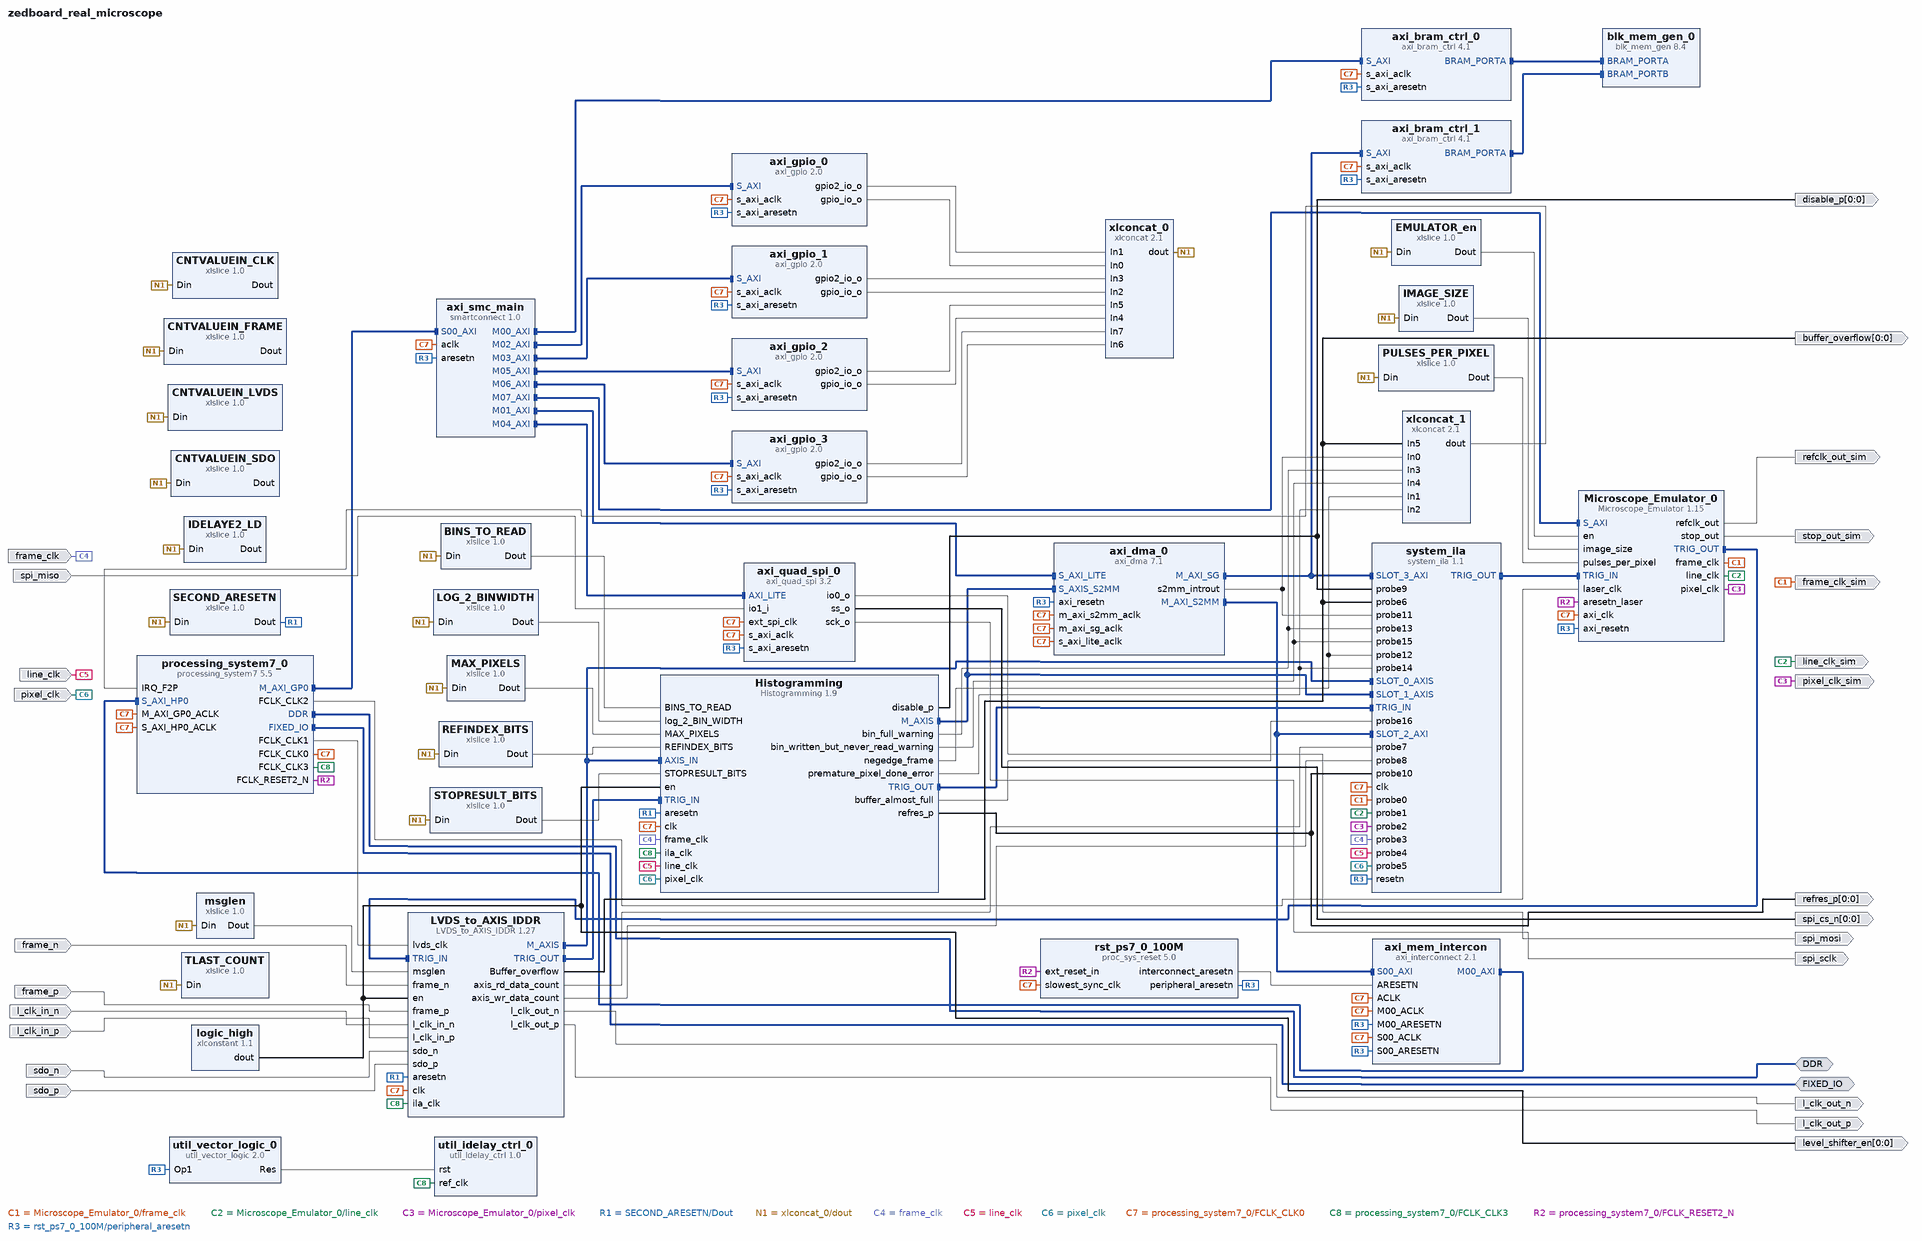
[diagram p0: block diagram of the top level]
# Vivado block design zedboard_real_microscope, xc7z020clg484-1, Vivado 2024.2
create_bd_design zedboard_real_microscope

create_bd_intf_port -mode Master -vlnv xilinx.com:interface:ddrx_rtl:1.0 DDR
create_bd_intf_port -mode Master -vlnv xilinx.com:display_processing_system7:fixedio_rtl:1.0 FIXED_IO
create_bd_port -dir I sdo_p
create_bd_port -dir I sdo_n
create_bd_port -dir I -type clk l_clk_in_p
create_bd_port -dir I -type clk l_clk_in_n
create_bd_port -dir I frame_p
create_bd_port -dir I frame_n
create_bd_port -dir O l_clk_out_n
create_bd_port -dir O l_clk_out_p
create_bd_port -dir O -from 0 -to 0 refres_p
create_bd_port -dir O -from 0 -to 0 disable_p
create_bd_port -dir O spi_mosi
create_bd_port -dir I spi_miso
create_bd_port -dir O spi_sclk
create_bd_port -dir O -from 0 -to 0 spi_cs_n
create_bd_port -dir O -from 0 -to 0 level_shifter_en
create_bd_port -dir O -from 0 -to 0 buffer_overflow
create_bd_port -dir I frame_clk
create_bd_port -dir I line_clk
create_bd_port -dir I pixel_clk
create_bd_port -dir O frame_clk_sim
create_bd_port -dir O line_clk_sim
create_bd_port -dir O pixel_clk_sim
create_bd_port -dir O refclk_out_sim
create_bd_port -dir O stop_out_sim

create_bd_cell -type ip -vlnv xilinx.com:ip:processing_system7:5.5 processing_system7_0
set_property -dict [list \
  CONFIG.PCW_APU_PERIPHERAL_FREQMHZ 667.0 \
  CONFIG.PCW_ENET0_ENET0_IO {MIO 16 .. 27} \
  CONFIG.PCW_ENET0_GRP_MDIO_ENABLE 1 \
  CONFIG.PCW_ENET0_GRP_MDIO_IO EMIO \
  CONFIG.PCW_ENET0_PERIPHERAL_ENABLE 1 \
  CONFIG.PCW_ENET_RESET_ENABLE 0 \
  CONFIG.PCW_EN_CLK1_PORT 1 \
  CONFIG.PCW_EN_CLK2_PORT 1 \
  CONFIG.PCW_EN_CLK3_PORT 1 \
  CONFIG.PCW_EN_RST0_PORT 0 \
  CONFIG.PCW_EN_RST2_PORT 1 \
  CONFIG.PCW_FCLK_CLK1_BUF TRUE \
  CONFIG.PCW_FCLK_CLK2_BUF TRUE \
  CONFIG.PCW_FCLK_CLK3_BUF TRUE \
  CONFIG.PCW_FPGA0_PERIPHERAL_FREQMHZ 100 \
  CONFIG.PCW_FPGA1_PERIPHERAL_FREQMHZ 250 \
  CONFIG.PCW_FPGA2_PERIPHERAL_FREQMHZ 10 \
  CONFIG.PCW_FPGA3_PERIPHERAL_FREQMHZ 200 \
  CONFIG.PCW_FPGA_FCLK1_ENABLE 1 \
  CONFIG.PCW_FPGA_FCLK2_ENABLE 1 \
  CONFIG.PCW_FPGA_FCLK3_ENABLE 1 \
  CONFIG.PCW_GPIO_MIO_GPIO_ENABLE 1 \
  CONFIG.PCW_GPIO_MIO_GPIO_IO MIO \
  CONFIG.PCW_I2C_RESET_ENABLE 0 \
  CONFIG.PCW_IRQ_F2P_INTR 1 \
  CONFIG.PCW_PERIPHERAL_BOARD_PRESET part0 \
  CONFIG.PCW_PRESET_BANK1_VOLTAGE {LVCMOS 1.8V} \
  CONFIG.PCW_QSPI_GRP_FBCLK_ENABLE 1 \
  CONFIG.PCW_QSPI_GRP_FBCLK_IO {MIO 8} \
  CONFIG.PCW_QSPI_GRP_SINGLE_SS_ENABLE 1 \
  CONFIG.PCW_QSPI_GRP_SINGLE_SS_IO {MIO 1 .. 6} \
  CONFIG.PCW_QSPI_PERIPHERAL_ENABLE 1 \
  CONFIG.PCW_QSPI_QSPI_IO {MIO 1 .. 6} \
  CONFIG.PCW_SD0_GRP_CD_ENABLE 1 \
  CONFIG.PCW_SD0_GRP_CD_IO {MIO 47} \
  CONFIG.PCW_SD0_GRP_WP_ENABLE 1 \
  CONFIG.PCW_SD0_GRP_WP_IO EMIO \
  CONFIG.PCW_SD0_PERIPHERAL_ENABLE 1 \
  CONFIG.PCW_SD0_SD0_IO {MIO 40 .. 45} \
  CONFIG.PCW_SDIO_PERIPHERAL_FREQMHZ 50 \
  CONFIG.PCW_SINGLE_QSPI_DATA_MODE x4 \
  CONFIG.PCW_TTC0_PERIPHERAL_ENABLE 1 \
  CONFIG.PCW_TTC0_TTC0_IO EMIO \
  CONFIG.PCW_UART1_PERIPHERAL_ENABLE 1 \
  CONFIG.PCW_UART1_UART1_IO {MIO 48 .. 49} \
  CONFIG.PCW_UART_PERIPHERAL_FREQMHZ 100 \
  CONFIG.PCW_UIPARAM_DDR_FREQ_MHZ 533.333 \
  CONFIG.PCW_UIPARAM_DDR_PARTNO {MT41K128M16 JT-125} \
  CONFIG.PCW_USB0_PERIPHERAL_ENABLE 1 \
  CONFIG.PCW_USB0_USB0_IO {MIO 28 .. 39} \
  CONFIG.PCW_USB_RESET_ENABLE 0 \
  CONFIG.PCW_USE_FABRIC_INTERRUPT 1 \
  CONFIG.PCW_USE_S_AXI_HP0 1 \
  CONFIG.preset None \
] [get_bd_cells processing_system7_0]
# 505 more settings of processing_system7_0 are not shown: defaults, MIO pin electricals, DDR timing, and values the tool derives
create_bd_cell -type ip -vlnv xilinx.com:ip:proc_sys_reset:5.0 rst_ps7_0_100M
create_bd_cell -type ip -vlnv xilinx.com:ip:axi_gpio:2.0 axi_gpio_0
set_property -dict [list \
  CONFIG.C_ALL_INPUTS_2 0 \
  CONFIG.C_ALL_OUTPUTS 1 \
  CONFIG.C_ALL_OUTPUTS_2 1 \
  CONFIG.C_GPIO2_WIDTH 32 \
  CONFIG.C_GPIO_WIDTH 32 \
  CONFIG.C_IS_DUAL 1 \
] [get_bd_cells axi_gpio_0]
create_bd_cell -type ip -vlnv xilinx.com:ip:xlslice:1.0 EMULATOR_en
set_property -dict {CONFIG.DIN_WIDTH 256} [get_bd_cells EMULATOR_en]
create_bd_cell -type ip -vlnv xilinx.com:ip:xlslice:1.0 msglen
set_property -dict {CONFIG.DIN_FROM 6 CONFIG.DIN_TO 1 CONFIG.DIN_WIDTH 256} [get_bd_cells msglen]
create_bd_cell -type ip -vlnv xilinx.com:ip:xlslice:1.0 SECOND_ARESETN
set_property -dict {CONFIG.DIN_FROM 12 CONFIG.DIN_TO 12 CONFIG.DIN_WIDTH 256} [get_bd_cells SECOND_ARESETN]
create_bd_cell -type ip -vlnv xilinx.com:ip:xlslice:1.0 CNTVALUEIN_LVDS
set_property -dict {CONFIG.DIN_FROM 11 CONFIG.DIN_TO 7 CONFIG.DIN_WIDTH 256} [get_bd_cells CNTVALUEIN_LVDS]
create_bd_cell -type ip -vlnv xilinx.com:ip:axi_quad_spi:3.2 axi_quad_spi_0
set_property -dict {CONFIG.C_FIFO_DEPTH 256 CONFIG.C_USE_STARTUP 0} [get_bd_cells axi_quad_spi_0]
create_bd_cell -type ip -vlnv xilinx.com:ip:axi_dma:7.1 axi_dma_0
set_property -dict {CONFIG.c_include_mm2s 0 CONFIG.c_s2mm_burst_size 16 CONFIG.c_sg_length_width 26} [get_bd_cells axi_dma_0]
create_bd_cell -type ip -vlnv xilinx.com:ip:axi_interconnect:2.1 axi_mem_intercon
set_property -dict {CONFIG.NUM_MI 1} [get_bd_cells axi_mem_intercon]
create_bd_cell -type ip -vlnv xilinx.com:ip:xlslice:1.0 LOG_2_BINWIDTH
set_property -dict {CONFIG.DIN_FROM 28 CONFIG.DIN_TO 13 CONFIG.DIN_WIDTH 256} [get_bd_cells LOG_2_BINWIDTH]
create_bd_cell -type ip -vlnv xilinx.com:ip:xlslice:1.0 REFINDEX_BITS
set_property -dict {CONFIG.DIN_FROM 98 CONFIG.DIN_TO 93 CONFIG.DIN_WIDTH 256} [get_bd_cells REFINDEX_BITS]
create_bd_cell -type ip -vlnv xilinx.com:ip:xlslice:1.0 STOPRESULT_BITS
set_property -dict {CONFIG.DIN_FROM 104 CONFIG.DIN_TO 99 CONFIG.DIN_WIDTH 256} [get_bd_cells STOPRESULT_BITS]
create_bd_cell -type ip -vlnv xilinx.com:ip:axi_gpio:2.0 axi_gpio_1
set_property -dict [list \
  CONFIG.C_ALL_INPUTS_2 0 \
  CONFIG.C_ALL_OUTPUTS 1 \
  CONFIG.C_ALL_OUTPUTS_2 1 \
  CONFIG.C_GPIO2_WIDTH 32 \
  CONFIG.C_GPIO_WIDTH 32 \
  CONFIG.C_IS_DUAL 1 \
] [get_bd_cells axi_gpio_1]
create_bd_cell -type ip -vlnv xilinx.com:ip:xlconcat:2.1 xlconcat_0
set_property -dict [list \
  CONFIG.IN0_WIDTH 32 \
  CONFIG.IN1_WIDTH 32 \
  CONFIG.IN2_WIDTH 32 \
  CONFIG.IN3_WIDTH 32 \
  CONFIG.IN4_WIDTH 32 \
  CONFIG.IN5_WIDTH 32 \
  CONFIG.IN6_WIDTH 32 \
  CONFIG.IN7_WIDTH 32 \
  CONFIG.NUM_PORTS 8 \
] [get_bd_cells xlconcat_0]
create_bd_cell -type ip -vlnv xilinx.com:ip:xlslice:1.0 TLAST_COUNT
set_property -dict {CONFIG.DIN_FROM 112 CONFIG.DIN_TO 105 CONFIG.DIN_WIDTH 256 CONFIG.DOUT_WIDTH 8} [get_bd_cells TLAST_COUNT]
create_bd_cell -type ip -vlnv xilinx.com:ip:xlconcat:2.1 xlconcat_1
set_property -dict {CONFIG.NUM_PORTS 6} [get_bd_cells xlconcat_1]
create_bd_cell -type ip -vlnv xilinx.com:ip:xlslice:1.0 BINS_TO_READ
set_property -dict {CONFIG.DIN_FROM 127 CONFIG.DIN_TO 113 CONFIG.DIN_WIDTH 256 CONFIG.DOUT_WIDTH 15} [get_bd_cells BINS_TO_READ]
create_bd_cell -type ip -vlnv xilinx.com:ip:xlslice:1.0 IMAGE_SIZE
set_property -dict {CONFIG.DIN_FROM 60 CONFIG.DIN_TO 29 CONFIG.DIN_WIDTH 256} [get_bd_cells IMAGE_SIZE]
create_bd_cell -type ip -vlnv xilinx.com:ip:xlslice:1.0 PULSES_PER_PIXEL
set_property -dict {CONFIG.DIN_FROM 92 CONFIG.DIN_TO 61 CONFIG.DIN_WIDTH 256} [get_bd_cells PULSES_PER_PIXEL]
create_bd_cell -type ip -vlnv xilinx.com:ip:util_vector_logic:2.0 util_vector_logic_0
set_property -dict {CONFIG.C_OPERATION not CONFIG.C_SIZE 1} [get_bd_cells util_vector_logic_0]
create_bd_cell -type ip -vlnv xilinx.com:ip:util_idelay_ctrl:1.0 util_idelay_ctrl_0
create_bd_cell -type ip -vlnv xilinx.com:ip:smartconnect:1.0 axi_smc_main
set_property -dict {CONFIG.NUM_CLKS 1 CONFIG.NUM_MI 8 CONFIG.NUM_SI 1} [get_bd_cells axi_smc_main]
create_bd_cell -type ip -vlnv xilinx.com:ip:axi_gpio:2.0 axi_gpio_2
set_property -dict [list \
  CONFIG.C_ALL_INPUTS_2 0 \
  CONFIG.C_ALL_OUTPUTS 1 \
  CONFIG.C_ALL_OUTPUTS_2 1 \
  CONFIG.C_GPIO2_WIDTH 32 \
  CONFIG.C_GPIO_WIDTH 32 \
  CONFIG.C_IS_DUAL 1 \
] [get_bd_cells axi_gpio_2]
create_bd_cell -type ip -vlnv xilinx.com:ip:axi_gpio:2.0 axi_gpio_3
set_property -dict [list \
  CONFIG.C_ALL_INPUTS 0 \
  CONFIG.C_ALL_INPUTS_2 0 \
  CONFIG.C_ALL_OUTPUTS 1 \
  CONFIG.C_ALL_OUTPUTS_2 1 \
  CONFIG.C_GPIO2_WIDTH 32 \
  CONFIG.C_GPIO_WIDTH 32 \
  CONFIG.C_IS_DUAL 1 \
] [get_bd_cells axi_gpio_3]
create_bd_cell -type ip -vlnv xilinx.com:ip:xlslice:1.0 MAX_PIXELS
set_property -dict {CONFIG.DIN_FROM 159 CONFIG.DIN_TO 128 CONFIG.DIN_WIDTH 256 CONFIG.DOUT_WIDTH 32} [get_bd_cells MAX_PIXELS]
create_bd_cell -type ip -vlnv xilinx.com:ip:blk_mem_gen:8.4 blk_mem_gen_0
set_property -dict [list \
  CONFIG.Assume_Synchronous_Clk true \
  CONFIG.EN_SAFETY_CKT false \
  CONFIG.Memory_Type True_Dual_Port_RAM \
  CONFIG.use_bram_block BRAM_Controller \
] [get_bd_cells blk_mem_gen_0]
create_bd_cell -type ip -vlnv xilinx.com:ip:axi_bram_ctrl:4.1 axi_bram_ctrl_1
set_property -dict {CONFIG.SINGLE_PORT_BRAM 1} [get_bd_cells axi_bram_ctrl_1]
create_bd_cell -type ip -vlnv xilinx.com:ip:axi_bram_ctrl:4.1 axi_bram_ctrl_0
set_property -dict {CONFIG.SINGLE_PORT_BRAM 1} [get_bd_cells axi_bram_ctrl_0]
create_bd_cell -type ip -vlnv xilinx.com:user:Histogramming:1.9 Histogramming
create_bd_cell -type ip -vlnv xilinx.com:user:LVDS_to_AXIS_IDDR:1.27 LVDS_to_AXIS_IDDR
create_bd_cell -type ip -vlnv xilinx.com:ip:xlconstant:1.1 logic_high
create_bd_cell -type ip -vlnv xilinx.com:ip:xlslice:1.0 CNTVALUEIN_CLK
set_property -dict {CONFIG.DIN_FROM 164 CONFIG.DIN_TO 160 CONFIG.DIN_WIDTH 256 CONFIG.DOUT_WIDTH 5} [get_bd_cells CNTVALUEIN_CLK]
create_bd_cell -type ip -vlnv xilinx.com:ip:xlslice:1.0 CNTVALUEIN_SDO
set_property -dict {CONFIG.DIN_FROM 169 CONFIG.DIN_TO 165 CONFIG.DIN_WIDTH 256 CONFIG.DOUT_WIDTH 5} [get_bd_cells CNTVALUEIN_SDO]
create_bd_cell -type ip -vlnv xilinx.com:ip:xlslice:1.0 IDELAYE2_LD
set_property -dict {CONFIG.DIN_FROM 175 CONFIG.DIN_TO 175 CONFIG.DIN_WIDTH 256 CONFIG.DOUT_WIDTH 1} [get_bd_cells IDELAYE2_LD]
create_bd_cell -type ip -vlnv xilinx.com:ip:xlslice:1.0 CNTVALUEIN_FRAME
set_property -dict [list \
  CONFIG.DIN_FROM 174 \
  CONFIG.DIN_TO 170 \
  CONFIG.DIN_WIDTH 256 \
  CONFIG.DOUT_WIDTH 5 \
] [get_bd_cells CNTVALUEIN_FRAME]
create_bd_cell -type ip -vlnv xilinx.com:user:Microscope_Emulator:1.15 Microscope_Emulator_0
create_bd_cell -type ip -vlnv xilinx.com:ip:system_ila:1.1 system_ila
set_property -dict [list \
  CONFIG.C_ADV_TRIGGER true \
  CONFIG.C_EN_STRG_QUAL 1 \
  CONFIG.C_MON_TYPE MIX \
  CONFIG.C_NUM_MONITOR_SLOTS 4 \
  CONFIG.C_NUM_OF_PROBES 17 \
  CONFIG.C_SLOT 1 \
  CONFIG.C_SLOT_0_INTF_TYPE xilinx.com:interface:axis_rtl:1.0 \
  CONFIG.C_SLOT_1_INTF_TYPE xilinx.com:interface:axis_rtl:1.0 \
  CONFIG.C_TRIGIN_EN true \
  CONFIG.C_TRIGOUT_EN true \
] [get_bd_cells system_ila]

# ---- connections ----

connect_bd_intf_net -intf_net Histogramming_0_M_AXIS [get_bd_intf_pins Histogramming/M_AXIS] [get_bd_intf_pins axi_dma_0/S_AXIS_S2MM]
connect_bd_intf_net [get_bd_intf_pins Histogramming/M_AXIS] [get_bd_intf_pins system_ila/SLOT_1_AXIS]
connect_bd_intf_net [get_bd_intf_pins Histogramming/TRIG_OUT] [get_bd_intf_pins system_ila/TRIG_IN]
connect_bd_intf_net [get_bd_intf_pins Histogramming/AXIS_IN] [get_bd_intf_pins LVDS_to_AXIS_IDDR/M_AXIS]
connect_bd_intf_net [get_bd_intf_pins Histogramming/AXIS_IN] [get_bd_intf_pins system_ila/SLOT_0_AXIS]
connect_bd_intf_net [get_bd_intf_pins LVDS_to_AXIS_IDDR/TRIG_OUT] [get_bd_intf_pins Histogramming/TRIG_IN]
connect_bd_intf_net [get_bd_intf_pins LVDS_to_AXIS_IDDR/TRIG_IN] [get_bd_intf_pins Microscope_Emulator_0/TRIG_OUT]
connect_bd_intf_net [get_bd_intf_pins axi_bram_ctrl_0/BRAM_PORTA] [get_bd_intf_pins blk_mem_gen_0/BRAM_PORTA]
connect_bd_intf_net [get_bd_intf_pins axi_bram_ctrl_1/BRAM_PORTA] [get_bd_intf_pins blk_mem_gen_0/BRAM_PORTB]
connect_bd_intf_net [get_bd_intf_pins axi_dma_0/M_AXI_S2MM] [get_bd_intf_pins axi_mem_intercon/S00_AXI]
connect_bd_intf_net [get_bd_intf_pins axi_dma_0/M_AXI_S2MM] [get_bd_intf_pins system_ila/SLOT_2_AXI]
connect_bd_intf_net [get_bd_intf_pins axi_bram_ctrl_1/S_AXI] [get_bd_intf_pins axi_dma_0/M_AXI_SG]
connect_bd_intf_net [get_bd_intf_pins axi_bram_ctrl_1/S_AXI] [get_bd_intf_pins system_ila/SLOT_3_AXI]
connect_bd_intf_net [get_bd_intf_pins axi_mem_intercon/M00_AXI] [get_bd_intf_pins processing_system7_0/S_AXI_HP0]
connect_bd_intf_net -intf_net axi_smc_M00_AXI [get_bd_intf_pins axi_smc_main/M00_AXI] [get_bd_intf_pins axi_bram_ctrl_0/S_AXI]
connect_bd_intf_net -intf_net axi_smc_M01_AXI [get_bd_intf_pins axi_smc_main/M01_AXI] [get_bd_intf_pins axi_dma_0/S_AXI_LITE]
connect_bd_intf_net -intf_net axi_smc_M02_AXI [get_bd_intf_pins axi_smc_main/M02_AXI] [get_bd_intf_pins axi_gpio_0/S_AXI]
connect_bd_intf_net -intf_net axi_smc_M03_AXI [get_bd_intf_pins axi_smc_main/M03_AXI] [get_bd_intf_pins axi_gpio_1/S_AXI]
connect_bd_intf_net -intf_net axi_smc_M04_AXI [get_bd_intf_pins axi_smc_main/M04_AXI] [get_bd_intf_pins axi_quad_spi_0/AXI_LITE]
connect_bd_intf_net [get_bd_intf_pins axi_smc_main/M05_AXI] [get_bd_intf_pins axi_gpio_2/S_AXI]
connect_bd_intf_net [get_bd_intf_pins axi_smc_main/M06_AXI] [get_bd_intf_pins axi_gpio_3/S_AXI]
connect_bd_intf_net [get_bd_intf_pins axi_smc_main/M07_AXI] [get_bd_intf_pins Microscope_Emulator_0/S_AXI]
connect_bd_intf_net [get_bd_intf_ports DDR] [get_bd_intf_pins processing_system7_0/DDR]
connect_bd_intf_net [get_bd_intf_ports FIXED_IO] [get_bd_intf_pins processing_system7_0/FIXED_IO]
connect_bd_intf_net [get_bd_intf_pins processing_system7_0/M_AXI_GP0] [get_bd_intf_pins axi_smc_main/S00_AXI]
connect_bd_intf_net [get_bd_intf_pins system_ila/TRIG_OUT] [get_bd_intf_pins Microscope_Emulator_0/TRIG_IN]
connect_bd_net -net ARESETN_1 [get_bd_pins rst_ps7_0_100M/interconnect_aresetn] [get_bd_pins axi_mem_intercon/ARESETN]
connect_bd_net [get_bd_pins BINS_TO_READ/Dout] [get_bd_pins Histogramming/BINS_TO_READ]
# net CNTVALUEIN_CLK_Dout has one end: CNTVALUEIN_CLK/Dout
# net CNTVALUEIN_FRAME_Dout has one end: CNTVALUEIN_FRAME/Dout
# net CNTVALUEIN_SDO_Dout has one end: CNTVALUEIN_SDO/Dout
connect_bd_net [get_bd_pins EMULATOR_en/Dout] [get_bd_pins Microscope_Emulator_0/en]
connect_bd_net -net Histogramming_0_buffer_almost_full [get_bd_pins Histogramming/buffer_almost_full] [get_bd_pins system_ila/probe16]
# net IDELAYE2_LD_Dout has one end: IDELAYE2_LD/Dout
connect_bd_net [get_bd_pins IMAGE_SIZE/Dout] [get_bd_pins Microscope_Emulator_0/image_size]
connect_bd_net [get_bd_pins LOG_2_BINWIDTH/Dout] [get_bd_pins Histogramming/log_2_BIN_WIDTH]
connect_bd_net -net LVDS_to_AXIS_0_Buffer_overflow [get_bd_pins LVDS_to_AXIS_IDDR/Buffer_overflow] \
  [get_bd_ports buffer_overflow] [get_bd_pins xlconcat_1/In5] [get_bd_pins system_ila/probe6]
connect_bd_net -net LVDS_to_AXIS_IDDR_0_axis_rd_data_count [get_bd_pins LVDS_to_AXIS_IDDR/axis_rd_data_count] [get_bd_pins system_ila/probe7]
connect_bd_net -net LVDS_to_AXIS_IDDR_0_axis_wr_data_count [get_bd_pins LVDS_to_AXIS_IDDR/axis_wr_data_count] [get_bd_pins system_ila/probe8]
connect_bd_net -net LVDS_to_AXIS_IDDR_0_l_clk_out_n [get_bd_pins LVDS_to_AXIS_IDDR/l_clk_out_n] [get_bd_ports l_clk_out_n]
connect_bd_net -net LVDS_to_AXIS_IDDR_0_l_clk_out_p [get_bd_pins LVDS_to_AXIS_IDDR/l_clk_out_p] [get_bd_ports l_clk_out_p]
connect_bd_net [get_bd_pins MAX_PIXELS/Dout] [get_bd_pins Histogramming/MAX_PIXELS]
connect_bd_net [get_bd_pins Microscope_Emulator_0/frame_clk] [get_bd_ports frame_clk_sim] [get_bd_pins system_ila/probe0]
connect_bd_net [get_bd_pins Microscope_Emulator_0/line_clk] [get_bd_ports line_clk_sim] [get_bd_pins system_ila/probe1]
connect_bd_net [get_bd_pins Microscope_Emulator_0/pixel_clk] [get_bd_ports pixel_clk_sim] [get_bd_pins system_ila/probe2]
connect_bd_net [get_bd_pins Microscope_Emulator_0/refclk_out] [get_bd_ports refclk_out_sim]
connect_bd_net [get_bd_pins Microscope_Emulator_0/stop_out] [get_bd_ports stop_out_sim]
connect_bd_net [get_bd_pins PULSES_PER_PIXEL/Dout] [get_bd_pins Microscope_Emulator_0/pulses_per_pixel]
connect_bd_net [get_bd_pins REFINDEX_BITS/Dout] [get_bd_pins Histogramming/REFINDEX_BITS]
connect_bd_net [get_bd_pins SECOND_ARESETN/Dout] [get_bd_pins Histogramming/aresetn] [get_bd_pins LVDS_to_AXIS_IDDR/aresetn]
connect_bd_net [get_bd_pins STOPRESULT_BITS/Dout] [get_bd_pins Histogramming/STOPRESULT_BITS]
connect_bd_net [get_bd_pins axi_dma_0/s2mm_introut] [get_bd_pins xlconcat_1/In0] [get_bd_pins system_ila/probe11]
connect_bd_net [get_bd_pins axi_gpio_0/gpio2_io_o] [get_bd_pins xlconcat_0/In1]
connect_bd_net -net axi_gpio_0_gpio_io_o [get_bd_pins xlconcat_0/dout] \
  [get_bd_pins EMULATOR_en/Din] [get_bd_pins msglen/Din] [get_bd_pins CNTVALUEIN_LVDS/Din] [get_bd_pins SECOND_ARESETN/Din] \
  [get_bd_pins LOG_2_BINWIDTH/Din] [get_bd_pins REFINDEX_BITS/Din] [get_bd_pins STOPRESULT_BITS/Din] \
  [get_bd_pins TLAST_COUNT/Din] [get_bd_pins BINS_TO_READ/Din] [get_bd_pins PULSES_PER_PIXEL/Din] \
  [get_bd_pins IMAGE_SIZE/Din] [get_bd_pins MAX_PIXELS/Din] [get_bd_pins CNTVALUEIN_CLK/Din] [get_bd_pins CNTVALUEIN_SDO/Din] \
  [get_bd_pins CNTVALUEIN_FRAME/Din] [get_bd_pins IDELAYE2_LD/Din]
connect_bd_net [get_bd_pins axi_gpio_0/gpio_io_o] [get_bd_pins xlconcat_0/In0]
connect_bd_net [get_bd_pins axi_gpio_1/gpio2_io_o] [get_bd_pins xlconcat_0/In3]
connect_bd_net [get_bd_pins axi_gpio_1/gpio_io_o] [get_bd_pins xlconcat_0/In2]
connect_bd_net [get_bd_pins axi_gpio_2/gpio2_io_o] [get_bd_pins xlconcat_0/In5]
connect_bd_net [get_bd_pins axi_gpio_2/gpio_io_o] [get_bd_pins xlconcat_0/In4]
connect_bd_net [get_bd_pins axi_gpio_3/gpio2_io_o] [get_bd_pins xlconcat_0/In7]
connect_bd_net [get_bd_pins axi_gpio_3/gpio_io_o] [get_bd_pins xlconcat_0/In6]
connect_bd_net [get_bd_pins axi_quad_spi_0/io0_o] [get_bd_ports spi_mosi]
connect_bd_net [get_bd_pins axi_quad_spi_0/sck_o] [get_bd_ports spi_sclk]
connect_bd_net [get_bd_pins axi_quad_spi_0/ss_o] [get_bd_ports spi_cs_n]
connect_bd_net -net frame_n_0_1 [get_bd_ports frame_n] [get_bd_pins LVDS_to_AXIS_IDDR/frame_n]
connect_bd_net -net frame_p_0_1 [get_bd_ports frame_p] [get_bd_pins LVDS_to_AXIS_IDDR/frame_p]
connect_bd_net -net histo_0_bin_full_warning [get_bd_pins Histogramming/bin_full_warning] \
  [get_bd_pins xlconcat_1/In3] [get_bd_pins system_ila/probe13]
connect_bd_net -net histo_0_bin_written_but_never_read_warning [get_bd_pins Histogramming/bin_written_but_never_read_warning] \
  [get_bd_pins xlconcat_1/In4] [get_bd_pins system_ila/probe15]
connect_bd_net -net histo_0_disable_p [get_bd_pins Histogramming/disable_p] [get_bd_ports disable_p] [get_bd_pins system_ila/probe9]
connect_bd_net -net histo_0_negedge_frame [get_bd_pins Histogramming/negedge_frame] [get_bd_pins xlconcat_1/In1] [get_bd_pins system_ila/probe12]
connect_bd_net -net histo_0_premature_pixel_done_error [get_bd_pins Histogramming/premature_pixel_done_error] \
  [get_bd_pins xlconcat_1/In2] [get_bd_pins system_ila/probe14]
connect_bd_net -net histo_0_refres_p [get_bd_pins Histogramming/refres_p] [get_bd_ports refres_p] [get_bd_pins system_ila/probe10]
connect_bd_net -net io1_i_0_1 [get_bd_ports spi_miso] [get_bd_pins axi_quad_spi_0/io1_i]
connect_bd_net [get_bd_ports l_clk_in_n] [get_bd_pins LVDS_to_AXIS_IDDR/l_clk_in_n]
connect_bd_net [get_bd_ports l_clk_in_p] [get_bd_pins LVDS_to_AXIS_IDDR/l_clk_in_p]
connect_bd_net -net laser_signal_generat_0_frame_clk_r [get_bd_ports frame_clk] [get_bd_pins Histogramming/frame_clk] [get_bd_pins system_ila/probe3]
connect_bd_net -net laser_signal_generat_0_line_clk_r [get_bd_ports line_clk] [get_bd_pins Histogramming/line_clk] [get_bd_pins system_ila/probe4]
connect_bd_net -net laser_signal_generat_0_pixel_clk_r [get_bd_ports pixel_clk] [get_bd_pins Histogramming/pixel_clk] [get_bd_pins system_ila/probe5]
connect_bd_net [get_bd_pins logic_high/dout] [get_bd_ports level_shifter_en] [get_bd_pins Histogramming/en] [get_bd_pins LVDS_to_AXIS_IDDR/en]
connect_bd_net [get_bd_pins msglen/Dout] [get_bd_pins LVDS_to_AXIS_IDDR/msglen]
connect_bd_net [get_bd_pins processing_system7_0/FCLK_CLK0] \
  [get_bd_pins axi_gpio_0/s_axi_aclk] [get_bd_pins axi_quad_spi_0/s_axi_aclk] \
  [get_bd_pins processing_system7_0/M_AXI_GP0_ACLK] [get_bd_pins axi_quad_spi_0/ext_spi_clk] \
  [get_bd_pins axi_dma_0/s_axi_lite_aclk] [get_bd_pins axi_dma_0/m_axi_s2mm_aclk] \
  [get_bd_pins processing_system7_0/S_AXI_HP0_ACLK] [get_bd_pins axi_mem_intercon/ACLK] \
  [get_bd_pins axi_mem_intercon/S00_ACLK] [get_bd_pins axi_mem_intercon/M00_ACLK] [get_bd_pins axi_gpio_1/s_axi_aclk] \
  [get_bd_pins axi_smc_main/aclk] [get_bd_pins axi_gpio_2/s_axi_aclk] [get_bd_pins axi_gpio_3/s_axi_aclk] \
  [get_bd_pins axi_bram_ctrl_1/s_axi_aclk] [get_bd_pins axi_bram_ctrl_0/s_axi_aclk] [get_bd_pins axi_dma_0/m_axi_sg_aclk] \
  [get_bd_pins rst_ps7_0_100M/slowest_sync_clk] [get_bd_pins Microscope_Emulator_0/axi_clk] [get_bd_pins system_ila/clk] \
  [get_bd_pins Histogramming/clk] [get_bd_pins LVDS_to_AXIS_IDDR/clk]
connect_bd_net [get_bd_pins processing_system7_0/FCLK_CLK1] [get_bd_pins LVDS_to_AXIS_IDDR/lvds_clk]
connect_bd_net [get_bd_pins processing_system7_0/FCLK_CLK2] [get_bd_pins Microscope_Emulator_0/laser_clk]
connect_bd_net [get_bd_pins processing_system7_0/FCLK_CLK3] \
  [get_bd_pins util_idelay_ctrl_0/ref_clk] [get_bd_pins Histogramming/ila_clk] [get_bd_pins LVDS_to_AXIS_IDDR/ila_clk]
connect_bd_net [get_bd_pins processing_system7_0/FCLK_RESET2_N] \
  [get_bd_pins rst_ps7_0_100M/ext_reset_in] [get_bd_pins Microscope_Emulator_0/aresetn_laser]
connect_bd_net [get_bd_pins rst_ps7_0_100M/peripheral_aresetn] \
  [get_bd_pins axi_gpio_0/s_axi_aresetn] [get_bd_pins axi_quad_spi_0/s_axi_aresetn] [get_bd_pins axi_dma_0/axi_resetn] \
  [get_bd_pins axi_mem_intercon/S00_ARESETN] [get_bd_pins axi_mem_intercon/M00_ARESETN] \
  [get_bd_pins axi_gpio_1/s_axi_aresetn] [get_bd_pins util_vector_logic_0/Op1] [get_bd_pins axi_smc_main/aresetn] \
  [get_bd_pins axi_gpio_2/s_axi_aresetn] [get_bd_pins axi_bram_ctrl_1/s_axi_aresetn] \
  [get_bd_pins axi_bram_ctrl_0/s_axi_aresetn] [get_bd_pins axi_gpio_3/s_axi_aresetn] \
  [get_bd_pins Microscope_Emulator_0/axi_resetn] [get_bd_pins system_ila/resetn]
connect_bd_net -net sdo_n_0_1 [get_bd_ports sdo_n] [get_bd_pins LVDS_to_AXIS_IDDR/sdo_n]
connect_bd_net -net sdo_p_0_1 [get_bd_ports sdo_p] [get_bd_pins LVDS_to_AXIS_IDDR/sdo_p]
connect_bd_net [get_bd_pins util_vector_logic_0/Res] [get_bd_pins util_idelay_ctrl_0/rst]
connect_bd_net [get_bd_pins xlconcat_1/dout] [get_bd_pins processing_system7_0/IRQ_F2P]
set_property HDL_ATTRIBUTE.BMM_INFO_PROCESSOR {arm > zedboard_real_microscope axi_bram_ctrl_0} [get_bd_cells processing_system7_0]
set_property HDL_ATTRIBUTE.KEEP_HIERARCHY yes [get_bd_cells processing_system7_0]
set_property HDL_ATTRIBUTE.BMM_INFO_ADDRESS_SPACE {byte  0x40000000 32 > zedboard_real_microscope blk_mem_gen_0} [get_bd_cells axi_bram_ctrl_0]
set_property HDL_ATTRIBUTE.KEEP_HIERARCHY yes [get_bd_cells axi_bram_ctrl_0]

# ---- address map ----
assign_bd_address -offset 0x00000000 -range 512M -target_address_space [get_bd_addr_spaces axi_dma_0/Data_S2MM] [get_bd_addr_segs processing_system7_0/S_AXI_HP0/HP0_DDR_LOWOCM]
assign_bd_address -offset 0x40000000 -range 4K -target_address_space [get_bd_addr_spaces axi_dma_0/Data_SG] [get_bd_addr_segs axi_bram_ctrl_1/S_AXI/Mem0]
assign_bd_address -offset 0x40000000 -range 4K -target_address_space [get_bd_addr_spaces processing_system7_0/Data] [get_bd_addr_segs axi_bram_ctrl_0/S_AXI/Mem0]
assign_bd_address -offset 0x40040000 -range 256K -target_address_space [get_bd_addr_spaces processing_system7_0/Data] [get_bd_addr_segs Microscope_Emulator_0/S_AXI/Mem0]
assign_bd_address -offset 0x40400000 -range 64K -target_address_space [get_bd_addr_spaces processing_system7_0/Data] [get_bd_addr_segs axi_dma_0/S_AXI_LITE/Reg]
assign_bd_address -offset 0x41200000 -range 64K -target_address_space [get_bd_addr_spaces processing_system7_0/Data] [get_bd_addr_segs axi_gpio_0/S_AXI/Reg]
assign_bd_address -offset 0x41210000 -range 64K -target_address_space [get_bd_addr_spaces processing_system7_0/Data] [get_bd_addr_segs axi_gpio_1/S_AXI/Reg]
assign_bd_address -offset 0x41220000 -range 64K -target_address_space [get_bd_addr_spaces processing_system7_0/Data] [get_bd_addr_segs axi_gpio_2/S_AXI/Reg]
assign_bd_address -offset 0x41230000 -range 64K -target_address_space [get_bd_addr_spaces processing_system7_0/Data] [get_bd_addr_segs axi_gpio_3/S_AXI/Reg]
assign_bd_address -offset 0x41E00000 -range 64K -target_address_space [get_bd_addr_spaces processing_system7_0/Data] [get_bd_addr_segs axi_quad_spi_0/AXI_LITE/Reg]

validate_bd_design
save_bd_design
